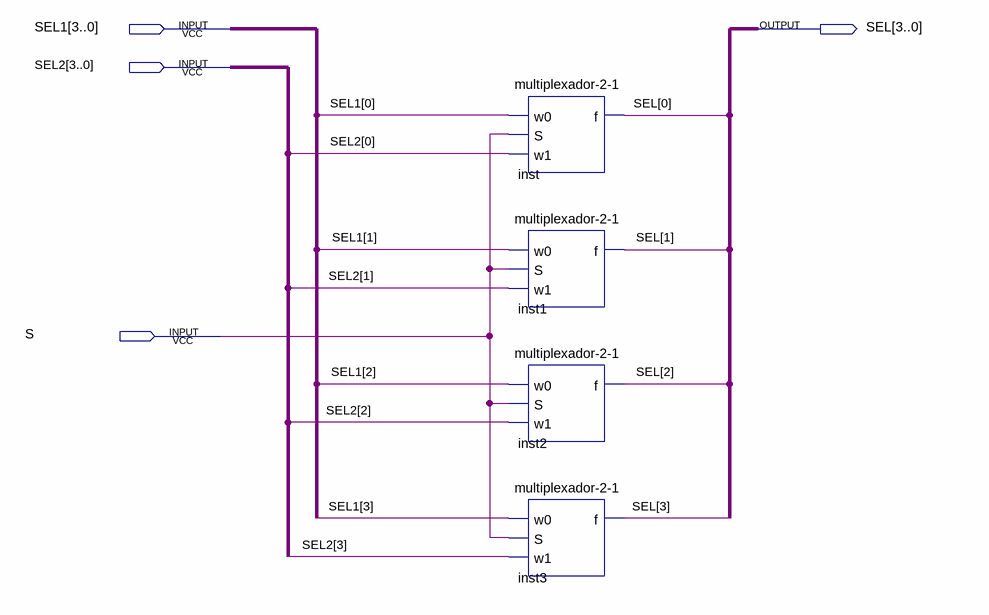
[diagram p0: schematic sheet]
// Quartus schematic mux8x4.bdf as structural Verilog: 4 symbols, 4 pins
module mux8x4 (
  input  [3:0] SEL1,
  input  [3:0] SEL2,
  input  S,
  output [3:0] SEL
);

  \multiplexador-2-1  inst (.w0(SEL1[0]), .S(S), .w1(SEL2[0]), .f(SEL[0]));
  \multiplexador-2-1  inst1 (.w0(SEL1[1]), .S(S), .w1(SEL2[1]), .f(SEL[1]));
  \multiplexador-2-1  inst2 (.w0(SEL1[2]), .S(S), .w1(SEL2[2]), .f(SEL[2]));
  \multiplexador-2-1  inst3 (.w0(SEL1[3]), .S(S), .w1(SEL2[3]), .f(SEL[3]));
endmodule
